# EAGLE schematic MainBoard (EAGLE 7.5.0)
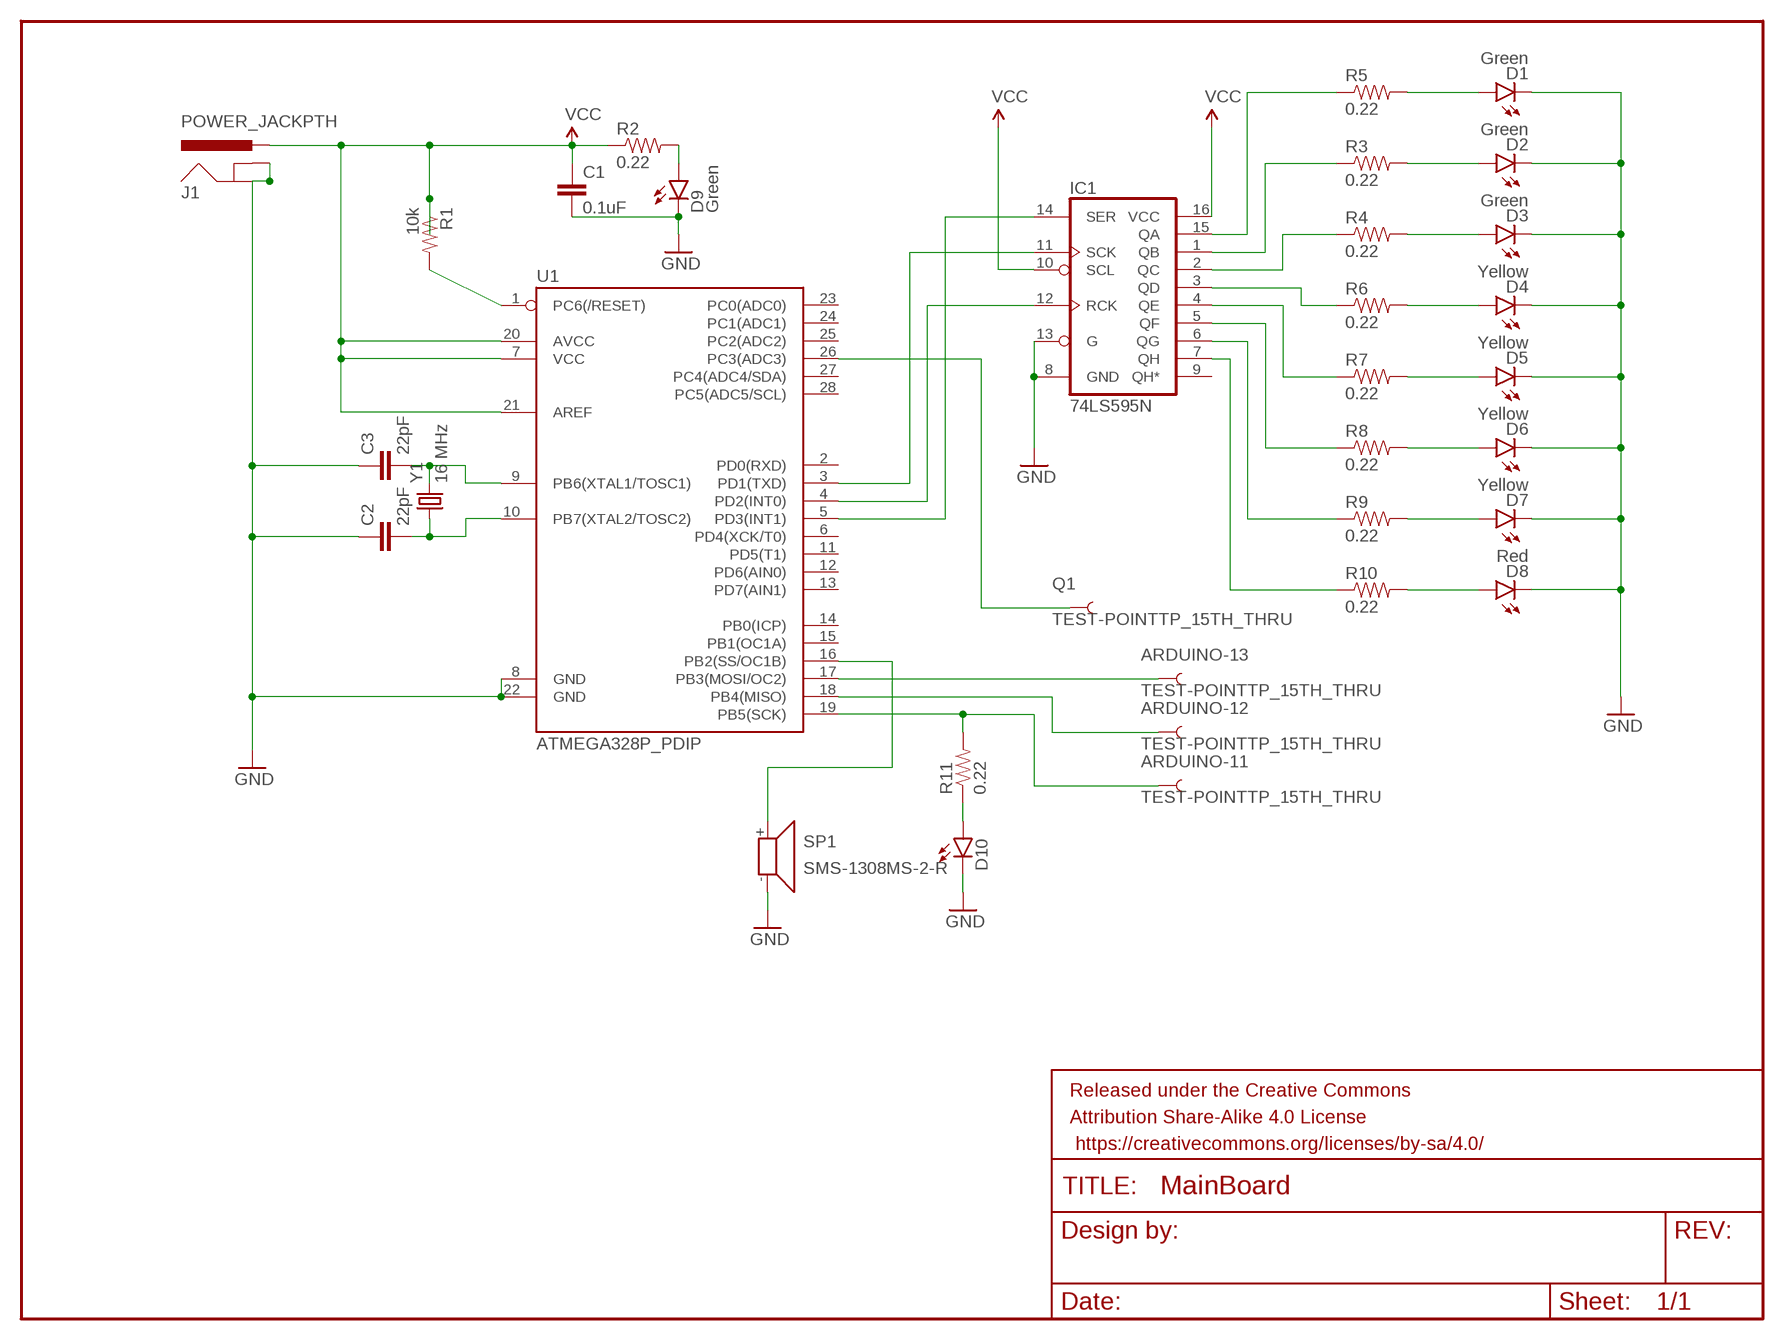
[diagram p0: schematic, sheet 1]

## Parts
ARDUINO-11  TEST-POINTTP_15TH_THRU  [TP_15TH]
ARDUINO-12  TEST-POINTTP_15TH_THRU  [TP_15TH]
ARDUINO-13  TEST-POINTTP_15TH_THRU  [TP_15TH]
C1  0.1uF  0.1UF-16V(+-10%)(0402)  [0402-CAP]
C2  22pF  22PF-50V-5%(0603)  [0603-CAP]
C3  22pF  22PF-50V-5%(0603)  [0603-CAP]
D1  Green  LED5MM  [LED5MM]
D2  Green  LED5MM  [LED5MM]
D3  Green  LED5MM  [LED5MM]
D4  Yellow  LED5MM  [LED5MM]
D5  Yellow  LED5MM  [LED5MM]
D6  Yellow  LED5MM  [LED5MM]
D7  Yellow  LED5MM  [LED5MM]
D8  Red  LED5MM  [LED5MM]
D9  Green  LED3MM  [LED3MM]
D10  LED5MM  [LED5MM]
FRAME1  FRAME-LETTER  [CREATIVE_COMMONS]
IC1  74LS595N  [DIL16]
J1  POWER_JACKPTH  [POWER_JACK_PTH]
Q1  TEST-POINTTP_15TH_THRU  [TP_15TH]
R1  10k  10KOHM-1/4W5%(PTH)  [AXIAL-0.3]
R2  0.22  0.22OHM-1/4W-1%(0805)  [0805]
R3  0.22  0.22OHM-1/4W-1%(0805)  [0805]
R4  0.22  0.22OHM-1/4W-1%(0805)  [0805]
R5  0.22  0.22OHM-1/4W-1%(0805)  [0805]
R6  0.22  0.22OHM-1/4W-1%(0805)  [0805]
R7  0.22  0.22OHM-1/4W-1%(0805)  [0805]
R8  0.22  0.22OHM-1/4W-1%(0805)  [0805]
R9  0.22  0.22OHM-1/4W-1%(0805)  [0805]
R10  0.22  0.22OHM-1/4W-1%(0805)  [0805]
R11  0.22  0.22OHM-1/4W-1%(0805)  [0805]
SP1  SMS-1308MS-2-R  [SMS-1308MS-2-R]
U1  ATMEGA328P_PDIP  [DIL28-3]
Y1  16 MHz  CRYSTALHC49US  [HC49US]

## Nets
GND: C1.2 C2.1 C3.1 D1.K(C) D2.K(C) D3.K(C) D4.K(C) D5.K(C) D6.K(C) D7.K(C) D8.K(C) D9.K(C) D10.K(C) IC1.8(GND) IC1.13(G) J1.GND J1.GNDBREAK SP1.- U1.8(GND) U1.22(GND)
N$1: R1.P$2 U1.1(PC6(/RESET))
N$2: D9.A R2.2
N$3: IC1.15(QA) R5.1
N$4: IC1.1(QB) R3.1
N$5: IC1.2(QC) R4.1
N$6: IC1.3(QD) R6.1
N$7: IC1.4(QE) R7.1
N$8: IC1.5(QF) R8.1
N$9: D1.A R5.2
N$10: D2.A R3.2
N$11: D3.A R4.2
N$12: D4.A R6.2
N$13: D5.A R7.2
N$14: D6.A R8.2
N$15: D7.A R9.2
N$16: D8.A R10.2
N$17: IC1.6(QG) R9.1
N$18: IC1.7(QH) R10.1
N$19: D10.A R11.1
N$20: ARDUINO-11.P$1 R11.2 U1.19(PB5(SCK))
N$21: ARDUINO-12.P$1 U1.18(PB4(MISO))
N$22: ARDUINO-13.P$1 U1.17(PB3(MOSI/OC2))
N$23: IC1.11(SCK) U1.3(PD1(TXD))
N$24: IC1.12(RCK) U1.4(PD2(INT0))
N$25: IC1.14(SER) U1.5(PD3(INT1))
N$26: C3.2 U1.9(PB6(XTAL1/TOSC1)) Y1.2
N$27: C2.2 U1.10(PB7(XTAL2/TOSC2)) Y1.1
N$28: Q1.P$1 U1.26(PC3(ADC3))
N$29: SP1.+ U1.16(PB2(SS/OC1B))
VCC: C1.1 IC1.10(SCL) IC1.16(VCC) J1.PWR R1.P$1 R2.1 U1.7(VCC) U1.20(AVCC) U1.21(AREF)
Unconnected: IC1.9(QH*) U1.2(PD0(RXD)) U1.6(PD4(XCK/T0)) U1.11(PD5(T1)) U1.12(PD6(AIN0)) U1.13(PD7(AIN1)) U1.14(PB0(ICP)) U1.15(PB1(OC1A)) U1.23(PC0(ADC0)) U1.24(PC1(ADC1)) U1.25(PC2(ADC2)) U1.27(PC4(ADC4/SDA)) U1.28(PC5(ADC5/SCL))

## Library data of the parts
ARDUINO-11-ARDUINO-13 Q1 = SparkFun-Passives:TEST-POINT: Bare copper test points for troubleshooting or ICT
C1 = SparkFun-Capacitors:0.1UF-16V(+-10%)(0402); PROD_ID: CAP-12416
C2 C3 = SparkFun-Capacitors:22PF-50V-5%(0603): CAP-07876; PROD_ID: CAP-07876
D1-D8 D10 = SparkFun-LED:LED: LEDs Standard schematic elements and footprints for 5mm, 3mm, 1206, and 0603 sized LEDs. 5mm - Spark Fun Electronics SKU : COM-00529 (and others)
D9 = SparkFun-LED:LED: LEDs Standard schematic elements and footprints for 5mm, 3mm, 1206, and 0603 sized LEDs. 5mm - Spark Fun Electronics SKU : COM-00529 (and others); PROD_ID: DIO-08794
FRAME1 = SparkFun-Aesthetics:FRAME-LETTER: Schematic Frame Standard 8.5x11 US Letter frame
IC1 = SparkFun-DigitalIC:74*595: 8-bit SHIFT REGISTER, output latch
J1 = SparkFun-Connectors:POWER_JACK: Power Jack This is the standard 5.5mm barrel jack for power. The PTH is the most common, proven, reliable, footprint. The Slot footprint only works if the mill layer is transmitted to the PCB fab house so be warned. Mating wall wart : TOL-00298 (and others); PROD_ID: CONN-08197
R1 = SparkFun-Resistors:10KOHM-1/4W5%(PTH): RES-09435; PROD_ID: RES-9435
R2-R11 = SparkFun-Resistors:0.22OHM-1/4W-1%(0805): RES-09883; PROD_ID: RES-09883
SP1 = speaker:SMS-1308MS-2-R: Speaker 13 x 13mm, 8 Ohm, 0.7W Source: pui audio inc. SMS-1308MS-2-R.pdf
U1 = SparkFun-DigitalIC:ATMEGA328P_PDIP: uC used in the Arduino 32kb flash, 1k EEPROM, 2k SRAM This is the through-hole version of this chip.
Y1 = SparkFun-FreqCtrl:CRYSTAL: Various standard crystals. Proven footprints.